# Altium schematic sheet MIPI-Bridge.SchDoc
size A
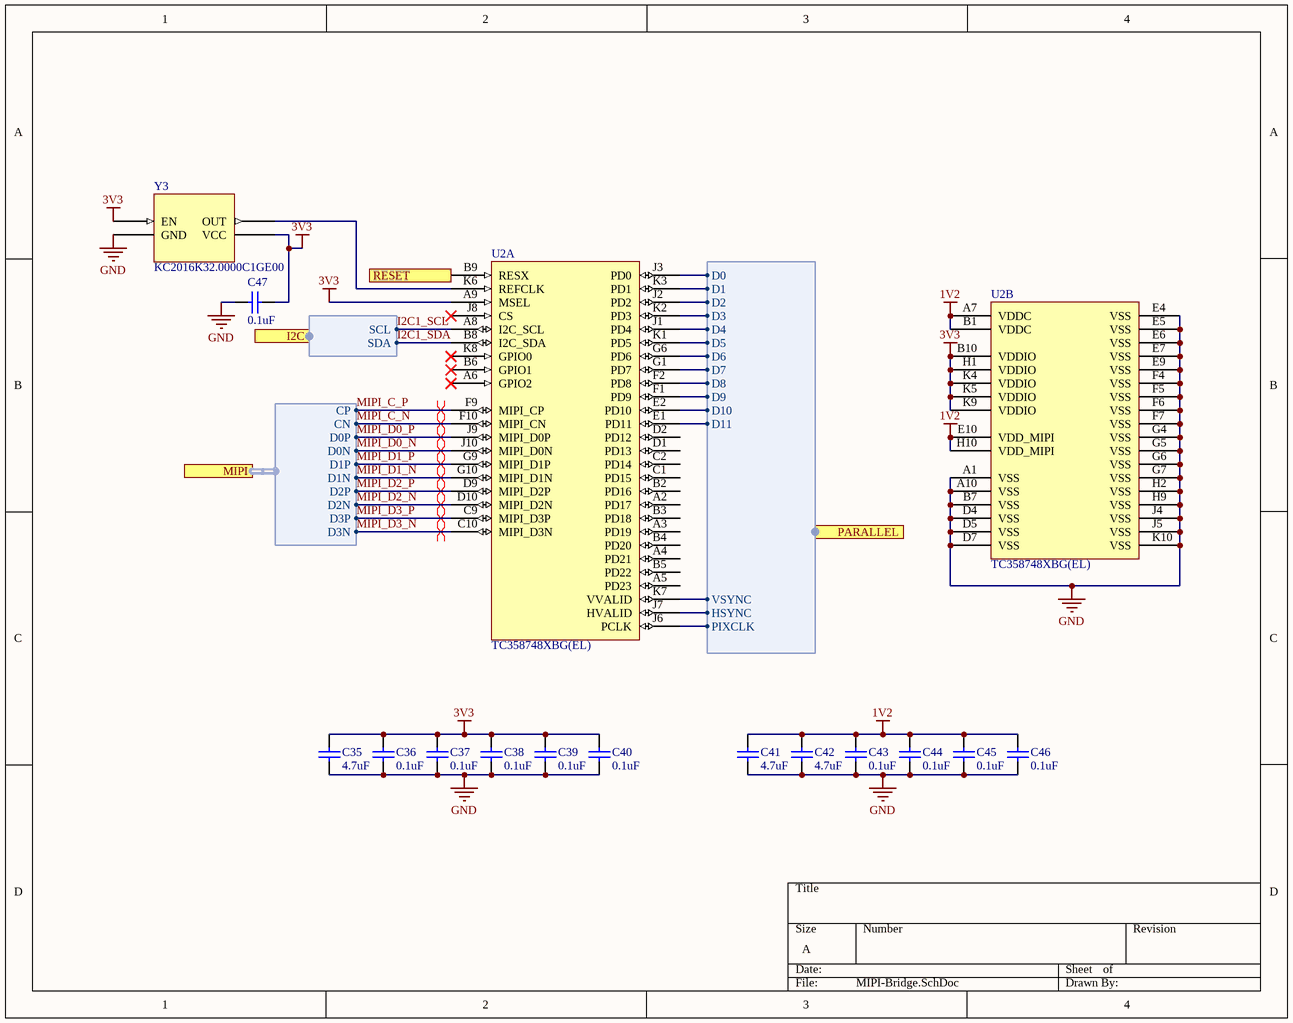
[diagram p0: MIPI-Bridge.SchDoc]

## Parts
C35  value 4.7uF  [C0402[1005X55]]  (hidden comment: 4.7uF 6.3V 0402)
C36  value 0.1uF  [C0402[1005X55]]  (hidden comment: 0.1uF 6.3V 0402)
C37  value 0.1uF  [C0402[1005X55]]  (hidden comment: 0.1uF 6.3V 0402)
C38  value 0.1uF  [C0402[1005X55]]  (hidden comment: 0.1uF 6.3V 0402)
C39  value 0.1uF  [C0402[1005X55]]  (hidden comment: 0.1uF 6.3V 0402)
C40  value 0.1uF  [C0402[1005X55]]  (hidden comment: 0.1uF 6.3V 0402)
C41  value 4.7uF  [C0402[1005X55]]  (hidden comment: 4.7uF 6.3V 0402)
C42  value 4.7uF  [C0402[1005X55]]  (hidden comment: 4.7uF 6.3V 0402)
C43  value 0.1uF  [C0402[1005X55]]  (hidden comment: 0.1uF 6.3V 0402)
C44  value 0.1uF  [C0402[1005X55]]  (hidden comment: 0.1uF 6.3V 0402)
C45  value 0.1uF  [C0402[1005X55]]  (hidden comment: 0.1uF 6.3V 0402)
C46  value 0.1uF  [C0402[1005X55]]  (hidden comment: 0.1uF 6.3V 0402)
C47  value 0.1uF  [C0402[1005X55]]  (hidden comment: 0.1uF 6.3V 0402)
U2  TC358748XBG(EL)  [BGA-80]  (parts A,B of 2)
Y3  KC2016K32.0000C1GE00  [KC2016K]

## Ports
I2C (harness I2C), MIPI (harness MIPI), PARALLEL (harness Parallel), RESET (in)

## Harnesses
I2C: SCL, SDA
Parallel: D2, D3, D1, D0, D6, D7, D5, D4, D10, D9, D8, PIXCLK, D11, HSYNC, VSYNC
MIPI: CP, CN, D0P, D0N, D1P, D1N, D2P, D2N, D3P, D3N

## Nets
1V2: C41.2 C42.2 C43.2 C44.2 C45.2 C46.2 U2.A7(VDDC) U2.B1(VDDC) U2.E10(VDD_MIPI) U2.H10(VDD_MIPI)
3V3: C35.2 C36.2 C37.2 C38.2 C39.2 C40.2 C47.1 U2.A9(MSEL) U2.B10(VDDIO) U2.H1(VDDIO) U2.K4(VDDIO) U2.K5(VDDIO) U2.K9(VDDIO) Y3.1(EN) Y3.4(VCC)
GND: C35.1 C36.1 C37.1 C38.1 C39.1 C40.1 C41.1 C42.1 C43.1 C44.1 C45.1 C46.1 C47.2 U2.A1(VSS) U2.A10(VSS) U2.B7(VSS) U2.D4(VSS) U2.D5(VSS) U2.D7(VSS) U2.E4(VSS) U2.E5(VSS) U2.E6(VSS) U2.E7(VSS) U2.E9(VSS) U2.F4(VSS) U2.F5(VSS) U2.F6(VSS) U2.F7(VSS) U2.G4(VSS) U2.G5(VSS) U2.G6(VSS) U2.G7(VSS) U2.H2(VSS) U2.H9(VSS) U2.J4(VSS) U2.J5(VSS) U2.K10(VSS) Y3.2(GND)
I2C1_SCL: U2.A8(I2C_SCL) ; port I2C.SCL
I2C1_SDA: U2.B8(I2C_SDA) ; port I2C.SDA
MIPI_C_N: U2.F10(MIPI_CN) ; port MIPI.CN
MIPI_C_P: U2.F9(MIPI_CP) ; port MIPI.CP
MIPI_D0_N: U2.J10(MIPI_D0N) ; port MIPI.D0N
MIPI_D0_P: U2.J9(MIPI_D0P) ; port MIPI.D0P
MIPI_D1_N: U2.G10(MIPI_D1N) ; port MIPI.D1N
MIPI_D1_P: U2.G9(MIPI_D1P) ; port MIPI.D1P
MIPI_D2_N: U2.D10(MIPI_D2N) ; port MIPI.D2N
MIPI_D2_P: U2.D9(MIPI_D2P) ; port MIPI.D2P
MIPI_D3_N: U2.C10(MIPI_D3N) ; port MIPI.D3N
MIPI_D3_P: U2.C9(MIPI_D3P) ; port MIPI.D3P
RESET: U2.B9(RESX) ; port RESET
NetU2_E1: U2.E1(PD11) ; port PARALLEL.D11
NetU2_E2: U2.E2(PD10) ; port PARALLEL.D10
NetU2_F1: U2.F1(PD9) ; port PARALLEL.D9
NetU2_F2: U2.F2(PD8) ; port PARALLEL.D8
NetU2_G1: U2.G1(PD7) ; port PARALLEL.D7
NetU2_G6: U2.G6(PD6) ; port PARALLEL.D6
NetU2_J1: U2.J1(PD4) ; port PARALLEL.D4
NetU2_J2: U2.J2(PD2) ; port PARALLEL.D2
NetU2_J3: U2.J3(PD0) ; port PARALLEL.D0
NetU2_J6: U2.J6(PCLK) ; port PARALLEL.PIXCLK
NetU2_J7: U2.J7(HVALID) ; port PARALLEL.HSYNC
NetU2_K1: U2.K1(PD5) ; port PARALLEL.D5
NetU2_K2: U2.K2(PD3) ; port PARALLEL.D3
NetU2_K3: U2.K3(PD1) ; port PARALLEL.D1
NetU2_K6: U2.K6(REFCLK) Y3.3(OUT)
NetU2_K7: U2.K7(VVALID) ; port PARALLEL.VSYNC

Not connected (* = marked no-connect by the designer): U2 A2(PD17) A3(PD19) A4(PD21) A5(PD23) A6(GPIO2)* B2(PD16) B3(PD18) B4(PD20) B5(PD22) B6(GPIO1)* C1(PD15) C2(PD14) D1(PD13) D2(PD12) J8(CS)* K8(GPIO0)*

## Layout directives
differential pair; differential pair class USB2: MIPI_C_N, MIPI_C_P, MIPI_D0_N, MIPI_D0_P, MIPI_D1_N, MIPI_D1_P, MIPI_D2_N, MIPI_D2_P, MIPI_D3_N, MIPI_D3_P

## Library data of the parts
C35 C41 C42 = CAP_4.7uF_6.3V_0402_20%: 4.7uF 6.3V 20% 0402 (1005 Metric); PartNumber: GRM155R60J475ME47D; Manufacturer: Murata; Mounting Technology: Surface Mount; PackageReference: 0402; PackageDescription: 0402 (1005 Metric); Voltage: 6.3V; Tolerance: 20%
C36-C40 C43-C47 = CAP_0.1uF_6.3V_0402_10%: 0.1uF 6.3V 10% 0402 (1005 Metric); PartNumber: GRM155R70J104KA01D; Manufacturer: Murata; Mounting Technology: Surface Mount; PackageReference: 0402; PackageDescription: 0402 (1005 Metric); Voltage: 6.3V; Tolerance: 10%
U2 = TC358748XBG(EL): IC MIPI CSI2 TO PARALLEL 80VFBGA; Manufacturer: Toshiba Semiconductor; PartNumber: TC358748XBG(EL); Mounting Technology: Surface Mount; PackageReference: BGA-80
Y3 = KC2016K32.0000C1GE00: OSC XO 32.0000MHZ CMOS SMD; Manufacturer: Kyocera; PartNumber: KC2016K32.0000C1GE00; Mounting Technology: Surface Mount; PackageReference: SMD-4